# Altium project KEY_LED_Panel_v1.PrjPcb
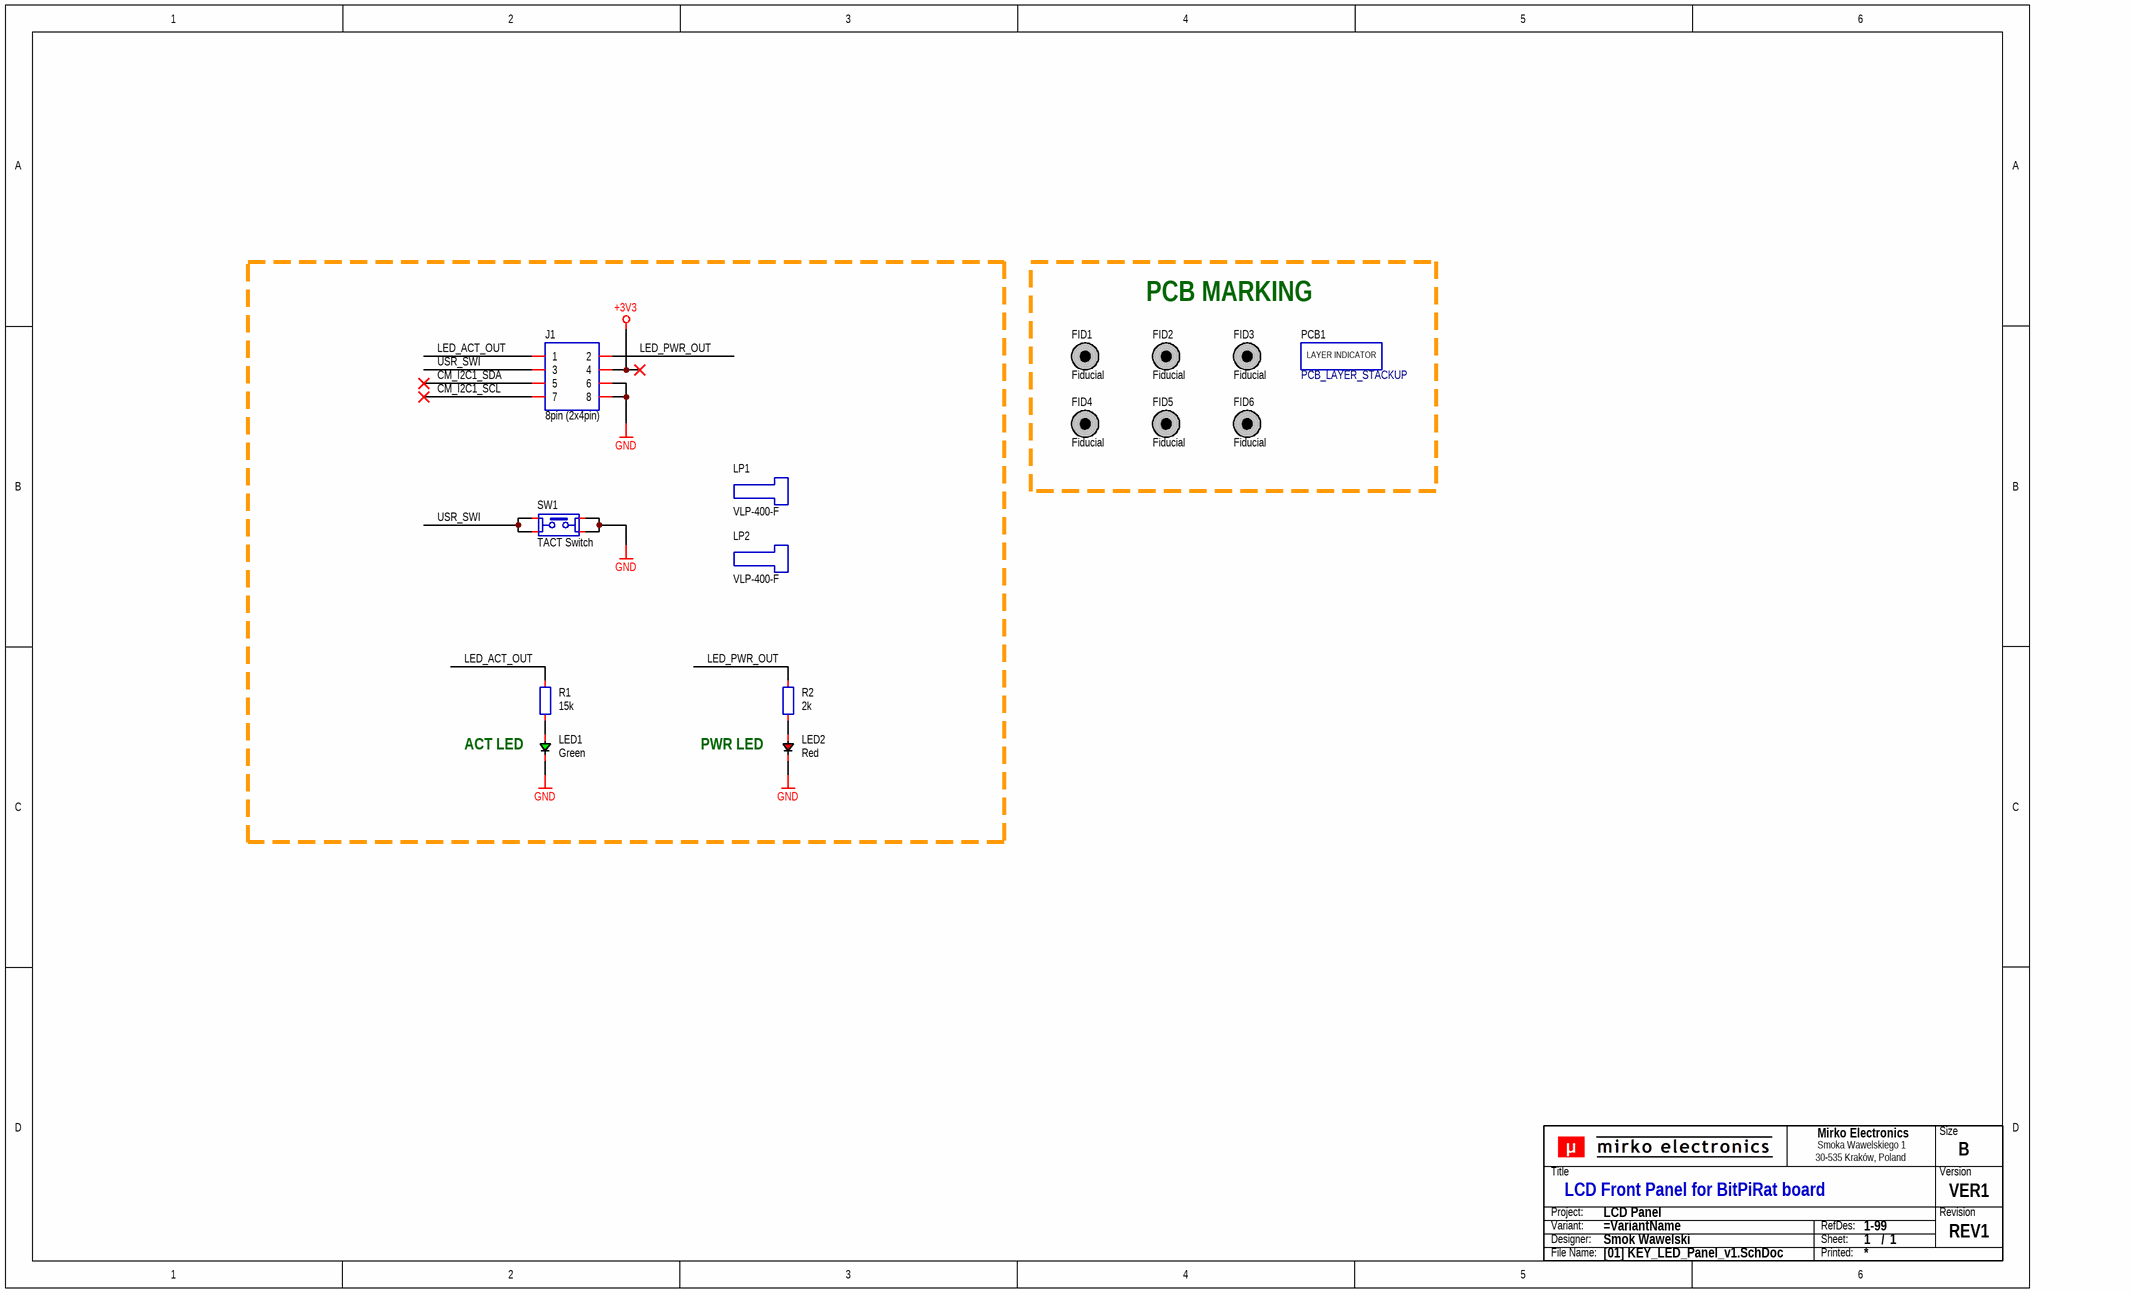
[diagram p0: [01] KEY_LED_Panel_v1.SchDoc]
GlobalProjectName: LCD Panel for BitPiRat; PCBProjectName: LCD Panel; SchPcbReleaseState: DRAFT; SchPcbRevision: REV1; SchPcbVersion: VER1
1 sheet, 16 parts. Net scope: global (net labels, ports and power ports of the same name join across sheets).
Board file: KEY_LED_Panel_v1.PcbDoc

## Sheet [01] KEY_LED_Panel_v1.SchDoc: LCD Front Panel for BitPiRat board
size B; Engineer: Smok Wawelski; DocumentNumber: 1; SheetNumber: 1; SheetTotal: 1; PageSize: B; Designators: 1-99

### Parts
FID1  Fiducial  [PCB_FID_RND_100x300]  (no BOM)
FID2  Fiducial  [PCB_FID_RND_100x300]  (no BOM)
FID3  Fiducial  [PCB_FID_RND_100x300]  (no BOM)
FID4  Fiducial  [PCB_FID_RND_100x300]  (no BOM)
FID5  Fiducial  [PCB_FID_RND_100x300]  (no BOM)
FID6  Fiducial  [PCB_FID_RND_100x300]  (no BOM)
J1  8pin (2x4pin)  [CON_IDC_SMD_P254_2X04]
LED1  Green  [LED_0805_GRN_R]
LED2  Red  [LED_0805_RED_R]
LP1  VLP-400-F  [LED_BVR_VLP-400-F]
LP2  VLP-400-F  [LED_BVR_VLP-400-F]
PCB1  PCB_LAYER_STACKUP  [PCB_STACKUP-2L_A1]  (no BOM)
R1  15k  [RES_0603_R]
R2  2k  [RES_0603_R]
SW1  TACT Switch  [SWI_SHR_1301.9319]
TB?  Title block  (value not drawn)  (graphical)

### Nets
+3V3: J1.4
GND: J1.6 J1.8 LED1.1 LED2.1 SW1.3 SW1.4
CM_I2C1_SCL: J1.7
CM_I2C1_SDA: J1.5
LED_ACT_OUT: J1.1 R1.2
LED_PWR_OUT: J1.2 R2.2
USR_SWI: J1.3 SW1.1 SW1.2
NetLED1_2: LED1.2 R1.1
NetLED2_2: LED2.2 R2.1

### Notes on the sheet
- PCB MARKING
- ACT LED
- PWR LED
- (in symbol PCB_LAYER_STACKUP) LAYER INDICATOR
- (in symbol SCH_TITLE_BLOCK_V1) Mirko Electronics; Size; Smoka Wawelskiego 1; 30-535 Kraków, Poland; Title; Version; Project:; Revision; Variant:; RefDes:; Designer:; Sheet:; /; File Name:; Printed:

### Library data of the parts
FID1-FID6 = PCB_FID_RND: PCB Marking; Fiducial; Round;; Value: Fiducial; Component Subtype: -; Component Type: Fiducial; Mounting Type: -; Supplier: ?
J1 = CON_2X04_ROW: Connector; 2 Row;; Manufacturer: GENERIC; Component Subtype: Pin Header; Package (Case): THT; Component Type: Connector; Mounting Type: THT; MPN: GENERIC; Supplier: ?; Value: 8pin (2x4pin)
LED1 = DIO_LED_GRN: Diode; LED; Green;; Manufacturer: Foshan NationStar Optoelectronics; MPN: NCD0805G1; Component Subtype: LED Diode; Package (Case): 0805 (2012); Value: Green; Component Type: LED; Mounting Type: SMD; Supplier: LCSC
LED2 = DIO_LED_RED: Diode; LED; Red;; Manufacturer: Foshan NationStar Optoelectronics; MPN: NCD0805R1; Component Subtype: LED Diode; Package (Case): 0805 (2012); Value: Red; Component Type: LED; Mounting Type: SMD; Supplier: LCSC
LP1 LP2 = LED_BVR_VLP-xxx: LED; Light pipe; Manufacturer: BIVAR; Component Type: Light pipe; Value: VLP-400-F
R1 = RES-0043: Resistor; Thick Film; 15k; 1%; 100mW; 100PPM; 75V; Standard; SMD; 0603 (1608);; Manufacturer: Yageo Corporation; MPN: TBD; Component Type: Resistor; Component Subtype: Thick Film; Value: 15k; Mounting Type: SMD; Package (Case): 0603 (1608); Supplier: ?
R2 = RES-0033: Resistor; Thick Film; 2k2; 1%; 100mW; 100PPM; 75V; Standard; SMD; 0603 (1608);; Manufacturer: Yageo Corporation; MPN: TBD; Component Type: Resistor; Component Subtype: Thick Film; Value: 2k; Mounting Type: SMD; Package (Case): 0603 (1608); Supplier: ?
SW1 = SWI_TACT_4P_AABB: Switch; Tactile; Monostable;; Manufacturer: SCHURTER; MPN: 1301.9319; Value: TACT Switch
TB? = SCH_TITLE_BLOCK_V1: Component Type: Title block; Manufacturer: -; Mounting Type: Non component; MPN: -; Operating Temperature: -; Package: -; Specification: Title block; Value: Title block; Replacement: -; System: ?
PCB1 = PCB_LAYER_STACKUP: Component Subtype: -; Component Type: PCB Marking; Mounting Type: -; Supplier: ?